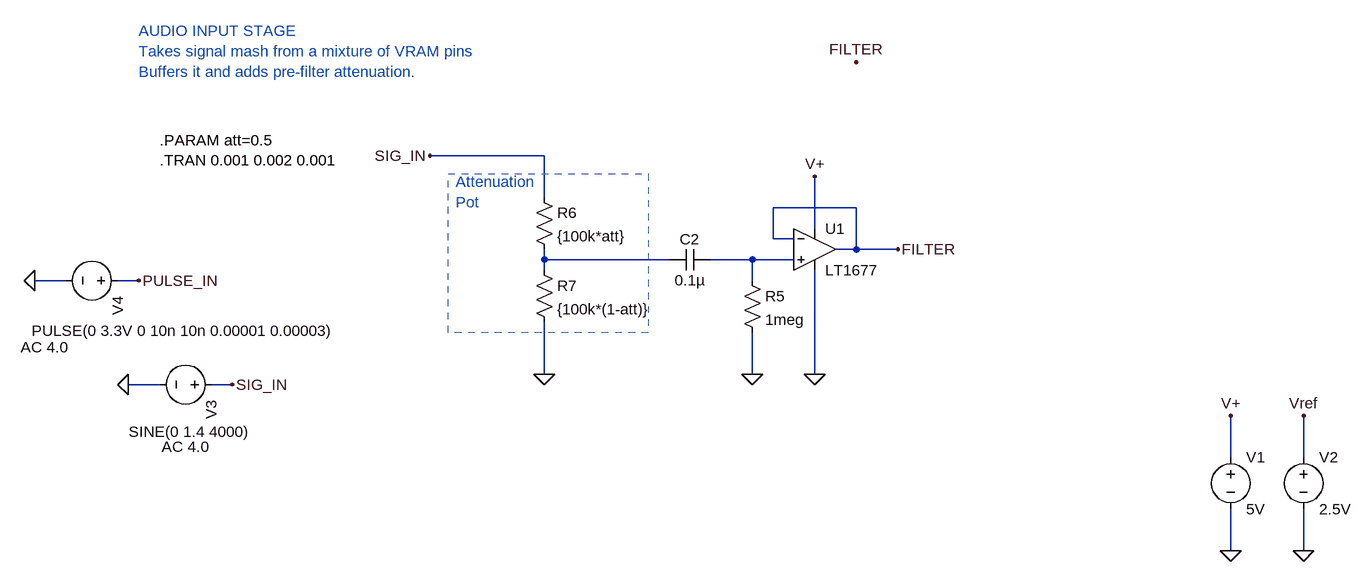
[diagram p0: schematic audio_input_stage.asc]
audio_input_stage.asc, the LTspice schematic file:
Version 4
SHEET 1 1228 1008
WIRE -752 144 -928 144
WIRE -752 208 -752 144
WIRE -272 224 -400 224
WIRE -336 256 -336 176
WIRE -400 272 -400 224
WIRE -368 272 -400 272
WIRE -272 288 -272 224
WIRE -272 288 -304 288
WIRE -208 288 -272 288
WIRE -752 304 -752 288
WIRE -560 304 -752 304
WIRE -432 304 -496 304
WIRE -368 304 -432 304
WIRE -752 320 -752 304
WIRE -1488 336 -1536 336
WIRE -1376 336 -1408 336
WIRE -432 336 -432 304
WIRE -752 480 -752 400
WIRE -432 480 -432 416
WIRE -336 480 -336 320
WIRE -1344 496 -1392 496
WIRE -1232 496 -1264 496
WIRE 304 608 304 544
WIRE 416 608 416 544
WIRE 304 752 304 688
WIRE 416 752 416 688
FLAG -928 144 SIG_IN
FLAG 416 544 Vref
FLAG 304 544 V+
FLAG -1392 496 0
FLAG -1232 496 SIG_IN
FLAG -336 480 0
FLAG -336 176 V+
FLAG -432 480 0
FLAG -752 480 0
FLAG 304 752 0
FLAG 416 752 0
FLAG -1536 336 0
FLAG -1376 336 PULSE_IN
FLAG -272 0 FILTER
FLAG -208 288 FILTER
SYMBOL res -768 192 R0
SYMATTR InstName R6
SYMATTR Value {100k*att}
SYMBOL res -768 304 R0
SYMATTR InstName R7
SYMATTR Value {100k*(1-att)}
SYMBOL cap -496 288 R90
WINDOW 0 0 32 VBottom 2
WINDOW 3 32 32 VTop 2
SYMATTR InstName C2
SYMATTR Value 0.1µ
SYMBOL voltage 304 592 R0
SYMATTR InstName V1
SYMATTR Value 5V
SYMBOL voltage -1248 496 R90
WINDOW 3 73 -43 VRight 2
WINDOW 123 96 19 VRight 2
SYMATTR Value SINE(0 1.4 4000)
SYMATTR Value2 AC 4.0
SYMATTR InstName V3
SYMATTR SpiceLine Rser=50
SYMBOL Opamps/LT1677 -336 224 R0
SYMATTR InstName U1
SYMBOL res -448 320 R0
SYMATTR InstName R5
SYMATTR Value 1meg
SYMBOL voltage 416 592 R0
SYMATTR InstName V2
SYMATTR Value 2.5V
SYMBOL voltage -1392 336 R90
WINDOW 3 77 -319 VRight 2
WINDOW 123 103 92 VRight 2
SYMATTR Value PULSE(0 3.3V 0 10n 10n 0.00001 0.00003)
SYMATTR Value2 AC 4.0
SYMATTR InstName V4
SYMATTR SpiceLine Rser=50
TEXT -1344 120 Left 2 !.PARAM att=0.5\n.TRAN 0.001 0.002 0.001
TEXT -888 184 Left 2 ;Attenuation\nPot
TEXT -1376 -48 Left 2 ;AUDIO INPUT STAGE\nTakes signal mash from a mixture of VRAM pins\nBuffers it and adds pre-filter attenuation.
RECTANGLE Normal -900 172 -592 416 3

The netlist it stands for:
* audio_input_stage.asc
R6 SIG_IN N001 {100k*att}
R7 N001 0 {100k*(1-att)}
C2 N002 N001 0.1µ
V1 V+ 0 5V
V3 SIG_IN 0 SINE(0 1.4 4000) AC 4.0 Rser=50
XU1 N002 FILTER V+ 0 FILTER LT1677  ; pins In+ In- V+ V- OUT
R5 N002 0 1meg
V2 Vref 0 2.5V
V4 PULSE_IN 0 PULSE(0 3.3V 0 10n 10n 0.00001 0.00003) AC 4.0 Rser=50
.PARAM att=0.5
.TRAN 0.001 0.002 0.001
* Attenuation
* Pot
* AUDIO INPUT STAGE
* Takes signal mash from a mixture of VRAM pins
* Buffers it and adds pre-filter attenuation.
.lib LTC.lib
.backanno
.end